# EAGLE design LIC_V-00237-02 (EAGLE 7.2.0)
AUTHOR: M. Petrilak; VERSION: 00
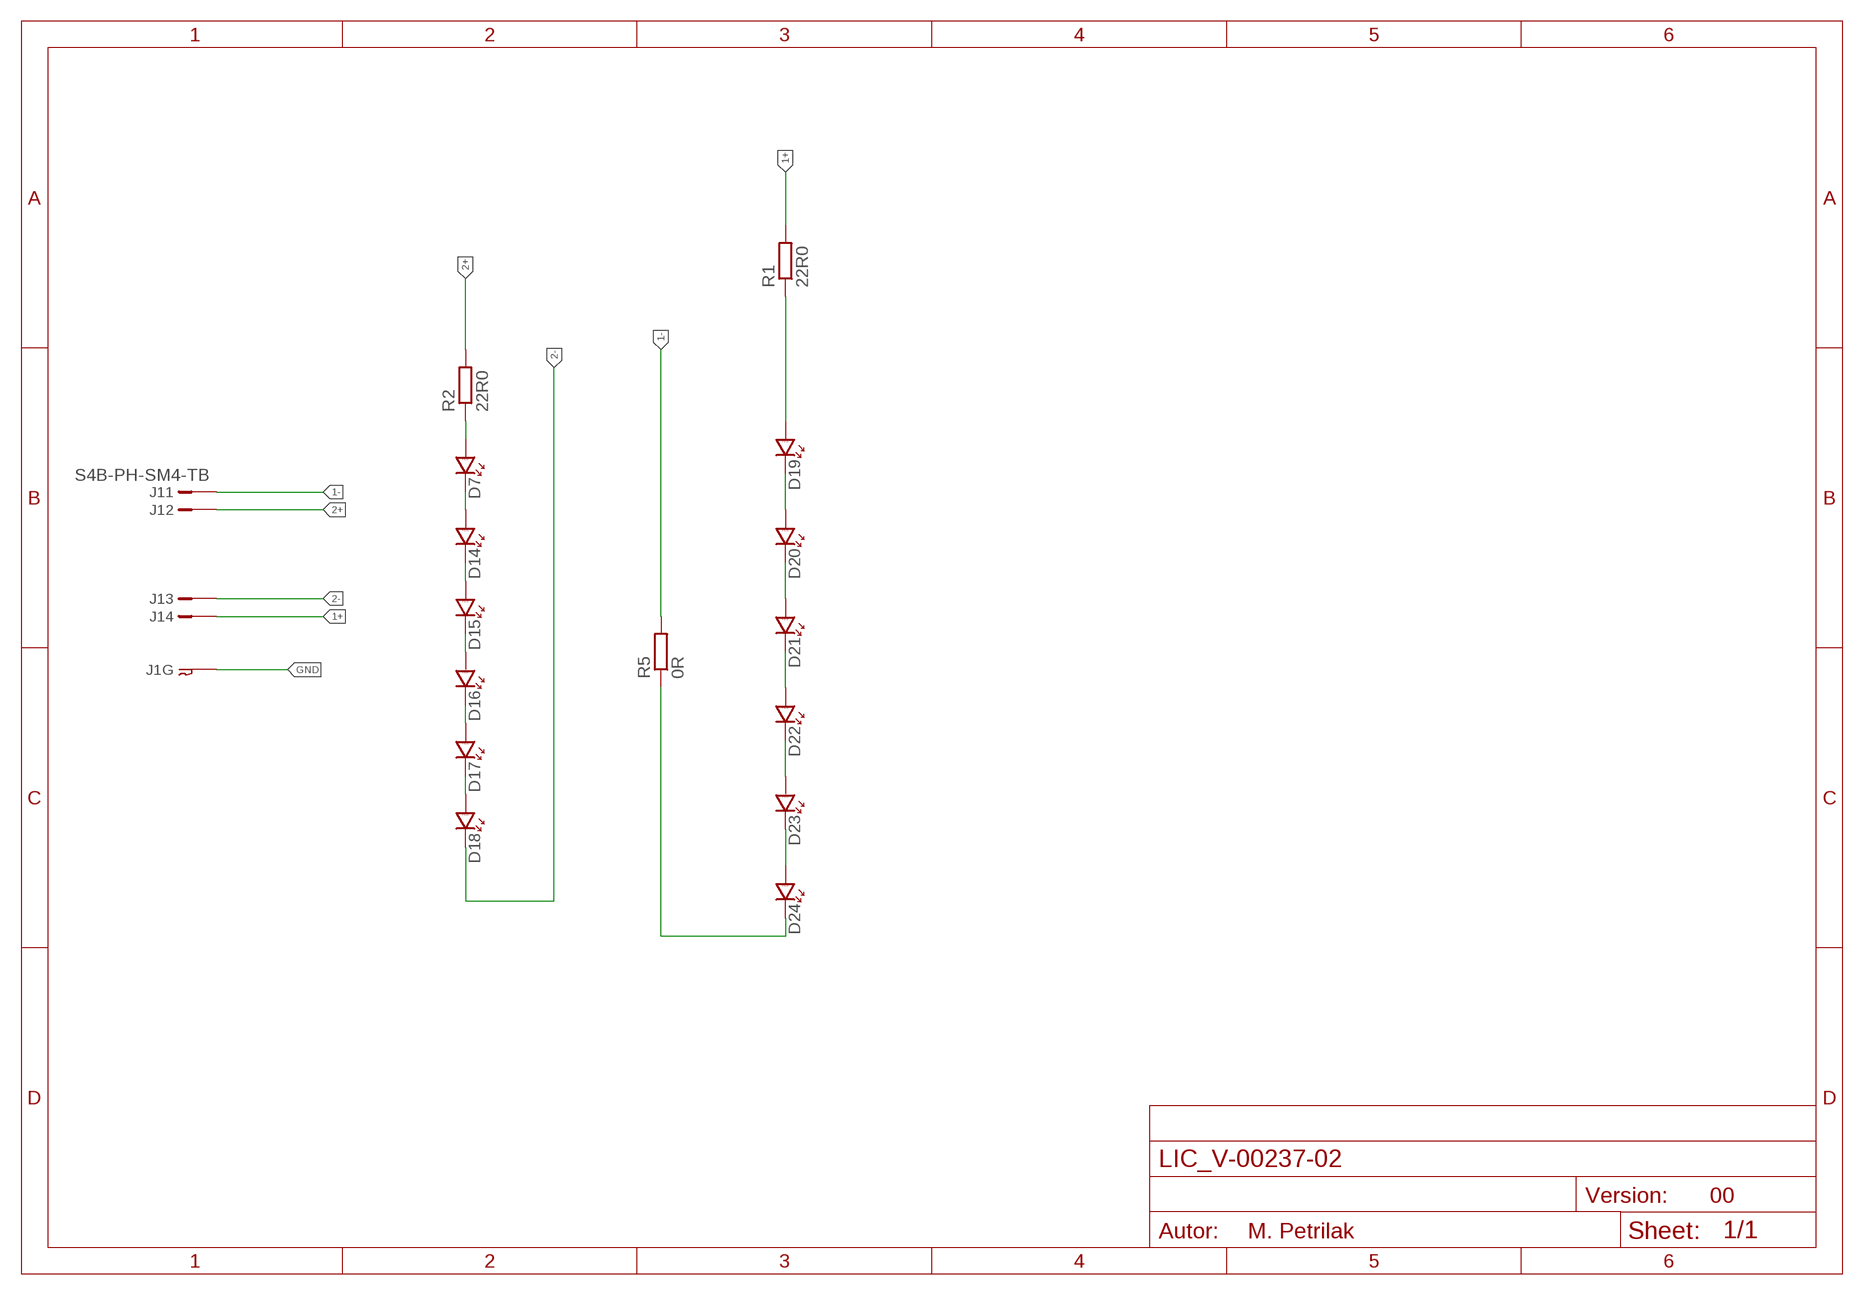
[diagram p0: schematic, sheet 1]

## Parts
D7  LED_1206  [P1206]
D14  LED_1206  [P1206]
D15  LED_1206  [P1206]
D16  LED_1206  [P1206]
D17  LED_1206  [P1206]
D18  LED_1206  [P1206]
D19  LED_1206  [P1206]
D20  LED_1206  [P1206]
D21  LED_1206  [P1206]
D22  LED_1206  [P1206]
D23  LED_1206  [P1206]
D24  LED_1206  [P1206]
J1  S4B-PH-SM4-TB  [S4B-PH-SM4-TB]
R1  22R0  R-EU_R1206  [R1206]
R2  22R0  R-EU_R1206  [R1206]
R5  0R  R-EU_R1206  [R1206]

## Nets
1+: J1.4 R1.2
1-: J1.1 R5.2
2+: J1.2 R2.2
2-: D18.K J1.3
GND: J1.GND1 J1.GND2
N$1: D7.K D14.A
N$2: D14.K D15.A
N$3: D15.K D16.A
N$4: D16.K D17.A
N$5: D17.K D18.A
N$6: D7.A R2.1
N$7: D19.K D20.A
N$8: D20.K D21.A
N$9: D21.K D22.A
N$10: D22.K D23.A
N$11: D19.A R1.1
N$12: D24.K R5.1
N$14: D23.K D24.A

## Library data of the parts
D7 D14-D24 = #PaJa_31:LED: LED - jednobarevna
J1 = con-jst:?4B-PH-SM4-TB: JST PH S4B-PH-SM4-TB pitch 2mm SMD side entry
R1 R2 R5 = rcl:R-EU_: RESISTOR, European symbol

## Board
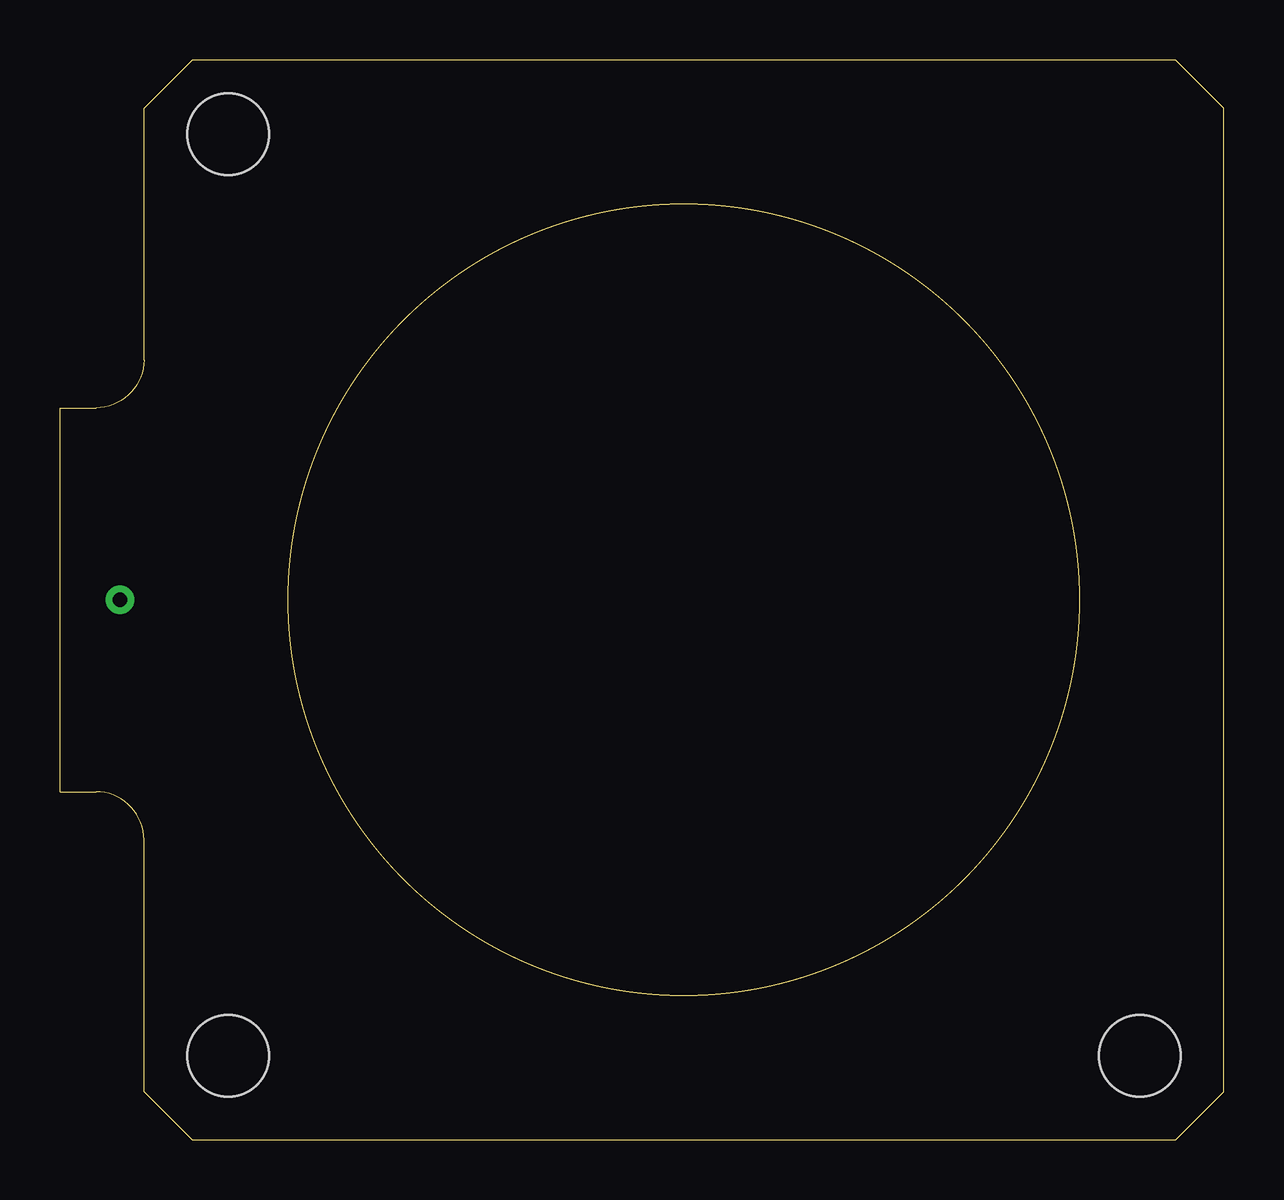
[diagram p1: board, top side]
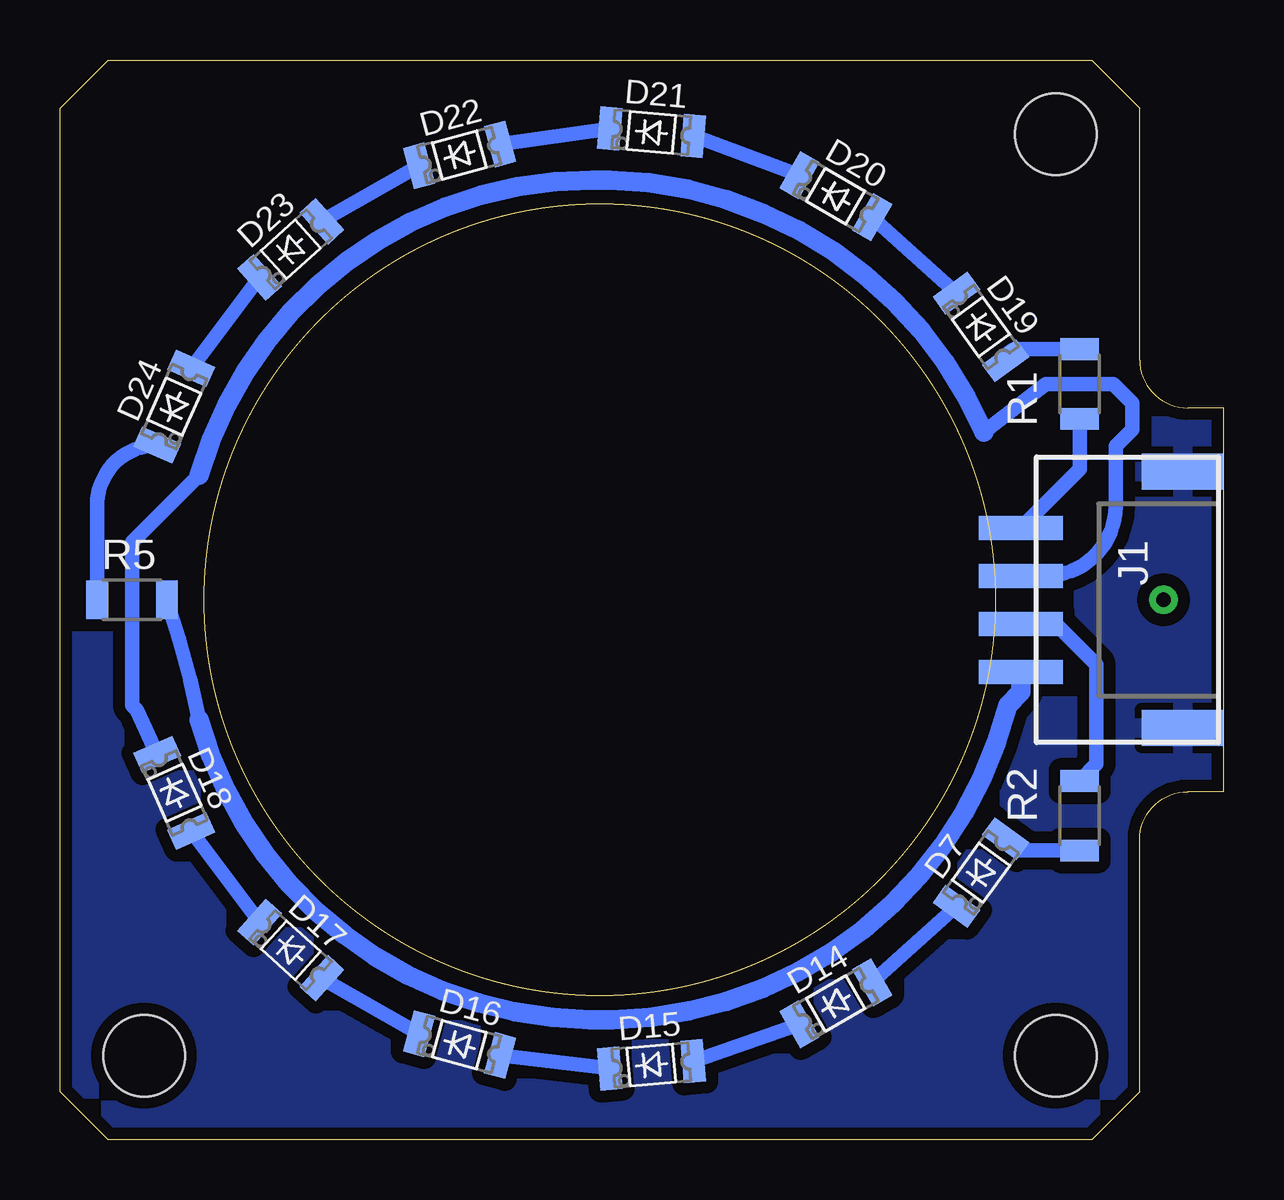
[diagram p2: board, bottom side, seen from below]

Size 48.5 x 45 mm. Coordinates in mm from the lower left corner, seen from the top.
Outline: 3.5,2 5.5,0 46.5,0 48.5,2 48.5,43 46.5,45 5.5,45 3.5,43 3.5,32.5 arc-90 1.5,30.5 0,30.5 0,14.5 1.5,14.5 arc-90 3.5,12.5 3.5,2
Outline: circle at 26,22.5 radius 16.5
Copper layers (1*16): Top 0.04mm / dielectric 1.5mm / Bottom 0.04mm
Design rules "mucha_navrh": minimum track width 0.2mm, minimum drill 0.6mm, track to track 0.5mm, track to pad 0.5mm, pad to pad 0.3mm, via to via 0.3mm, smd to smd 0mil, copper to edge 0.5mm, drill to drill 0.5mm, minimum pad ring 0.3mm, minimum via ring 0.3mm, stop-mask expansion 0.1mm, vias tented up to drill 0.8mm, thermal gap 0.3mm
Holes 3.4 mm at 7,3.5 45,3.5 7,41.9

### Footprints (pad centres in the part's own frame; a part is rotated, then mirrored left to right if it is on the bottom)
P1206 = smd 0.914 x 1.778: A -1.905,0; K 1.587,0
S4B-PH-SM4-TB = smd 1 x 3.5: 1 3,-8.25; 2 1,-8.25; 3 -1,-8.25; 4 -3,-8.25 | smd 1.5 x 3.4: GND1 -5.35,-1.5; GND2 5.35,-1.5
R1206 = smd 0.9 x 1.6: 1 -1.45,0; 2 1.45,0

### Placement (x,y rotation side)
D7  10.2,11 234 bottom
D14  16.3,5.6 210 bottom
D15  24,3.1 185 bottom
D16  32,4 165 bottom
D17  39,8 138 bottom
D18  43.8,14.6 114 bottom
D19  10.2,34 126 bottom
D20  16.3,39.4 150 bottom
D21  24,42 175 bottom
D22  32,41 195 bottom
D23  39,37 222 bottom
D24  43.8,30.4 246 bottom
J1  0.2,22.5 270 bottom
R1  6,31.5 270 bottom
R2  6,13.5 90 bottom
R5  45.5,22.5 0 bottom

### Tracks (layer width: path | path; a pad name or v marks a point on that pad's centre or on a via)
1+
  Bottom 0.61: R1.2 6,27.95 J1.4
1-
  Bottom 0.61: 42.7,17.5 arc-8 R5.2
  Bottom 0.813: 42.7,17.5 arc-74 26.4,5 25.5,5 arc-75 9,18.1 8.45,18.65 J1.1
2+
  Bottom 0.61: R2.2 5.3,15.65 5.3,19.8 7,21.5 J1.2
2-
  Bottom 0.61: J1.3 7.4,23.5 arc-90 4.5,26.4 4.5,28.9 3.8,29.6 3.8,30.7 4.6,31.5 7.4,31.5 10,29.5 | 42.7,27.7 45.5,24.9 45.5,18.1 45.3,17.9 D18.K
  Bottom 0.813: 10,29.5 arc-65 25.6,40 26.3,40 arc-74 42.7,27.7
GND
  pour Bottom (rank 4): 0,0 48.5,0 48.5,45 0,45
N$1
  Bottom 0.61: D14.A D7.K
N$2
  Bottom 0.61: D14.K D15.A
N$3
  Bottom 0.61: D15.K D16.A
N$4
  Bottom 0.61: D16.K D17.A
N$5
  Bottom 0.61: D18.A D17.K
N$6
  Bottom 0.61: D7.A 8.59,12.05 R2.1
N$7
  Bottom 0.61: D19.K D20.A
N$8
  Bottom 0.61: D20.K D21.A
N$9
  Bottom 0.61: D21.K D22.A
N$10
  Bottom 0.61: D22.K D23.A
N$11
  Bottom 0.61: R1.1 8.59,32.95 arc-90 D19.A
N$12
  Bottom 0.61: R5.1 46.95,26.45 arc90 D24.K
N$14
  Bottom 0.61: D23.K D24.A
THERMAL  (via drill 0.6)
  other vias: 2.5,22.5